# EAGLE schematic tutorial (EAGLE 9.4.0)
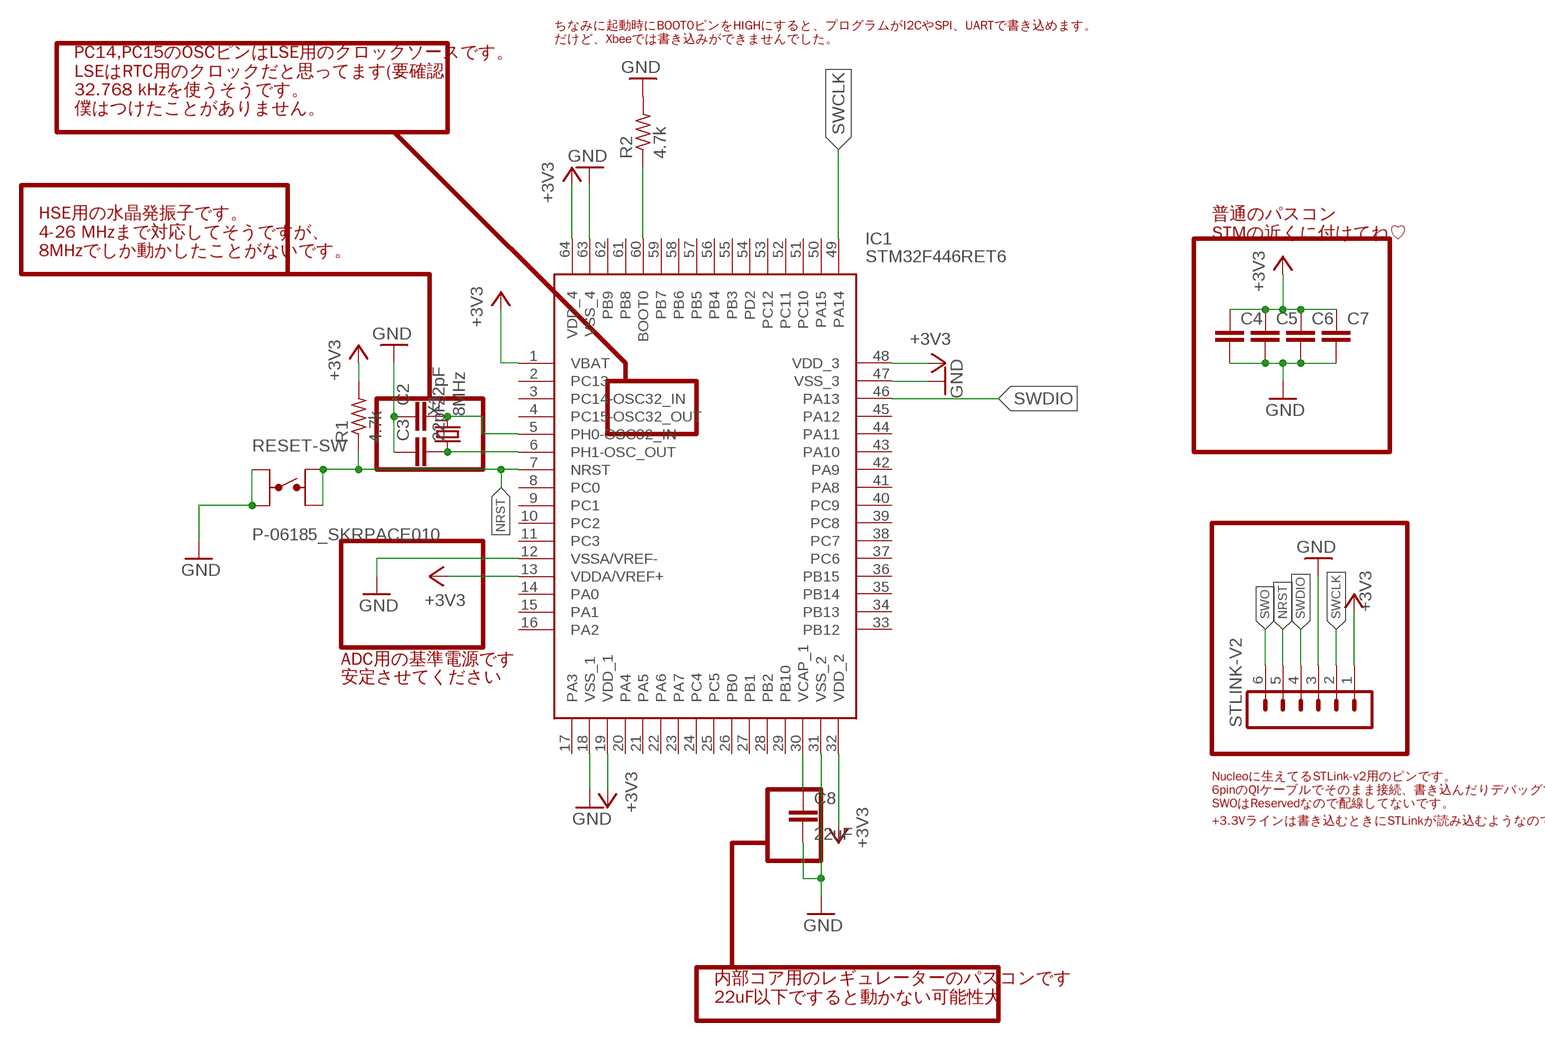
[diagram p0: schematic, sheet 1]

## Parts
C2  22pF  C-EUC1608  [C1608]
C3  22pF  C-EUC1608  [C1608]
C4  C-EUC0805  [C0805]
C5  C-EUC0805  [C0805]
C6  C-EUC0805  [C0805]
C7  C-EUC0805  [C0805]
C8  22uF  C-EUC0805  [C0805]
IC1  STM32F446RET6  [QFP50P1200X1200X160-64N]
R1  4.7k  R-US_M0805  [M0805]
R2  4.7k  R-US_M0805  [M0805]
RESET-SW  P-06185_SKRPACE010  [SKRP]
STLINK-V2  MA06-1  [MA06-1]
X1  8MHz  P-08669_HUSG-12.000-20  [HC49U-V]

## Nets
+3V3: C4.1 C5.1 C6.1 C7.1 IC1.1(VBAT) IC1.13(VDDA/VREF+) IC1.19(VDD_1) IC1.32(VDD_2) IC1.48(VDD_3) IC1.64(VDD_4) R1.2 STLINK-V2.1
GND: C2.1 C3.1 C4.2 C5.2 C6.2 C7.2 C8.2 IC1.12(VSSA/VREF-) IC1.18(VSS_1) IC1.31(VSS_2) IC1.47(VSS_3) IC1.63(VSS_4) R2.2 RESET-SW.1A(P$1A) RESET-SW.1B(P$1B) STLINK-V2.3
N$1: C3.2 IC1.6(PH1-OSC_OUT) X1.1
N$2: C2.2 IC1.5(PH0-OSC32_IN) X1.2
N$3: IC1.60(BOOT0) R2.1
N$13: C8.1 IC1.30(VCAP_1)
NRST: IC1.7(NRST) R1.1 RESET-SW.2A(P$2A) RESET-SW.2B(P$2B) STLINK-V2.5
SWCLK: IC1.49(PA14) STLINK-V2.2
SWDIO: IC1.46(PA13) STLINK-V2.4
SWO: STLINK-V2.6
Unconnected: IC1.2(PC13) IC1.3(PC14-OSC32_IN) IC1.4(PC15-OSC32_OUT) IC1.8(PC0) IC1.9(PC1) IC1.10(PC2) IC1.11(PC3) IC1.14(PA0) IC1.15(PA1) IC1.16(PA2) IC1.17(PA3) IC1.20(PA4) IC1.21(PA5) IC1.22(PA6) IC1.23(PA7) IC1.24(PC4) IC1.25(PC5) IC1.26(PB0) IC1.27(PB1) IC1.28(PB2) IC1.29(PB10) IC1.33(PB12) IC1.34(PB13) IC1.35(PB14) IC1.36(PB15) IC1.37(PC6) IC1.38(PC7) IC1.39(PC8) IC1.40(PC9) IC1.41(PA8) IC1.42(PA9) IC1.43(PA10) IC1.44(PA11) IC1.45(PA12) IC1.50(PA15) IC1.51(PC10) IC1.52(PC11) IC1.53(PC12) IC1.54(PD2) IC1.55(PB3) IC1.56(PB4) IC1.57(PB5) IC1.58(PB6) IC1.59(PB7) IC1.61(PB8) IC1.62(PB9)

## Notes on the sheet
- ちなみに起動時にBOOT0ピンをHIGHにすると、プログラムがI2CやSPI、UARTで書き込めます。
  だけど、Xbeeでは書き込みができませんでした。
- PC14,PC15のOSCピンはLSE用のクロックソースです。
  LSEはRTC用のクロックだと思ってます(要確認)
  32.768 kHzを使うそうです。
  僕はつけたことがありません。
- 普通のパスコン
  STMの近くに付けてね♡
- HSE用の水晶発振子です。
  4-26 MHzまで対応してそうですが、
  8MHzでしか動かしたことがないです。
- ADC用の基準電源です
- 安定させてください
- Nucleoに生えてるSTLink-v2用のピンです。
  6pinのQIケーブルでそのまま接続、書き込んだりデバッグできたりします。
  SWOはReservedなので配線してないです。
- +3.3Vラインは書き込むときにSTLinkが読み込むようなのでここから給電はできないです
- 内部コア用のレギュレーターのパスコンです
  22uF以下ですると動かない可能性大

## Library data of the parts
C2-C8 = resistor:C-EU: CAPACITOR, European symbol
IC1 = STM32F446RET6:STM32F446RET6: 32-Bit MCU+DSP 512K Flash 180MHz LQFP64 STMicroelectronics STM32F446RET6, 32bit ARM Cortex M4 MCU, 180MHz, 512 kB Flash, 64-Pin LQFP Source: Datasheet <http://docs-emea.rs-online.com/webdocs/14d7/0900766b814d7c59.pdf>; DESCRIPTION: 32-Bit MCU+DSP 512K Flash 180MHz LQFP64 STMicroelectronics STM32F446RET6, 32bit ARM Cortex M4 MCU, 180MHz, 512 kB Flash, 64-Pin LQFP; HEIGHT: 1.6mm; MANUFACTURER_NAME: STMicroelectronics; MANUFACTURER_PART_NUMBER: STM32F446RET6; MOUSER_PART_NUMBER: 511-STM32F446RET6; MOUSER_PRICE-STOCK: https://www.mouser.com/Search/Refine.aspx?Keyword=511-STM32F446RET6; RS_PART_NUMBER: 1106621P; RS_PRICE-STOCK: http://uk.rs-online.com/web/p/products/1106621P
R1 R2 = resistor:R-US_: RESISTOR, American symbol
RESET-SW = Akizuki:P-06185_SKRPACE010
STLINK-V2 = con-lstb:MA06-1: PIN HEADER; OC_FARNELL: unknown; OC_NEWARK: unknown
X1 = Akizuki:P-08669_HUSG-12.000-20